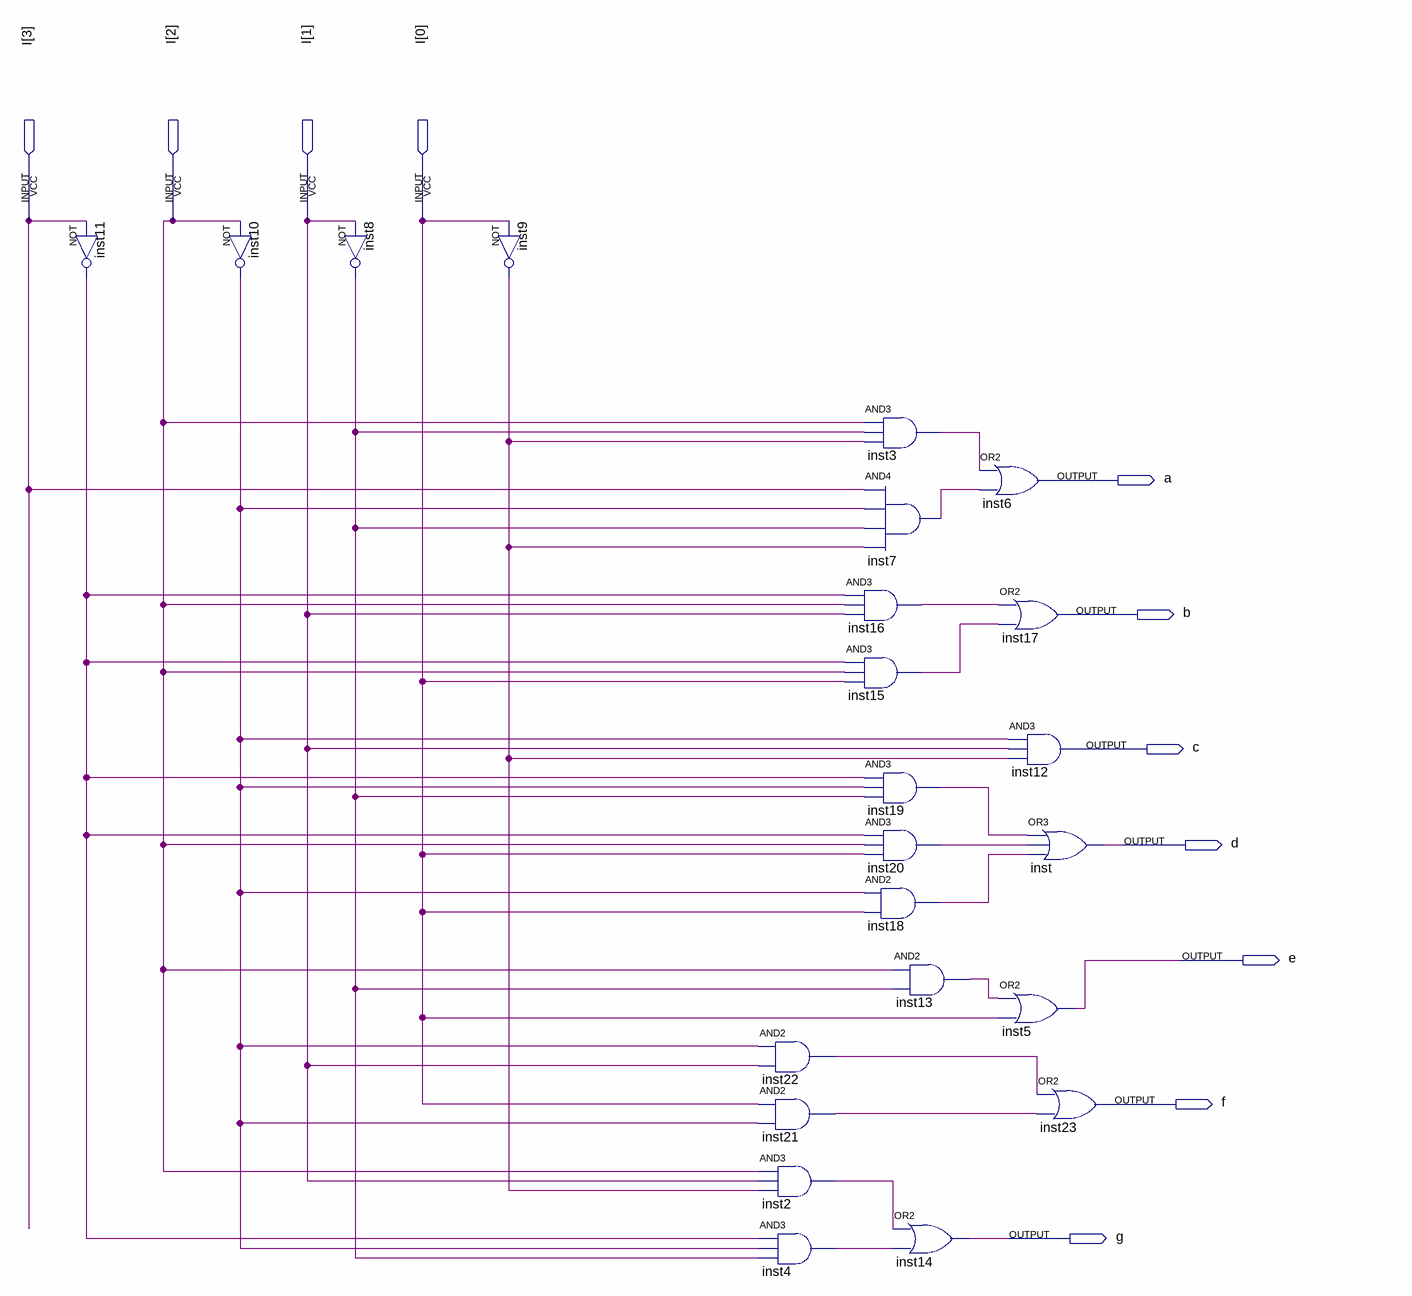
[diagram p0: schematic sheet]
// Quartus schematic bit4ToBCD.bdf as structural Verilog: 23 symbols, 11 pins
module bit4ToBCD (
  input  [3:0] I,
  output a,
  output b,
  output c,
  output d,
  output e,
  output f,
  output g
);

  wire inst2_out, inst3_out, inst4_out, inst7_out, inst8_out, inst9_out, inst10_out, inst11_out, inst13_out,
       inst15_out, inst16_out, inst18_out, inst19_out, inst20_out, inst21_out, inst22_out;

  not inst11 (inst11_out, I[3]);
  not inst10 (inst10_out, I[2]);
  not inst8 (inst8_out, I[1]);
  not inst9 (inst9_out, I[0]);
  and inst22 (inst22_out, inst10_out, I[1]);
  and inst21 (inst21_out, I[0], inst10_out);
  and inst2 (inst2_out, I[2], I[1], inst9_out);
  and inst4 (inst4_out, inst11_out, inst10_out, inst8_out);
  and inst3 (inst3_out, I[2], inst8_out, inst9_out);
  and inst7 (inst7_out, I[3], inst10_out, inst8_out, inst9_out);
  and inst16 (inst16_out, inst11_out, I[2], I[1]);
  and inst15 (inst15_out, inst11_out, I[2], I[0]);
  and inst19 (inst19_out, inst11_out, inst10_out, inst8_out);
  and inst20 (inst20_out, inst11_out, I[2], I[0]);
  and inst18 (inst18_out, inst10_out, I[0]);
  and inst13 (inst13_out, I[2], inst8_out);
  or inst14 (g, inst2_out, inst4_out);
  or inst6 (a, inst3_out, inst7_out);
  or inst17 (b, inst16_out, inst15_out);
  and inst12 (c, inst10_out, I[1], inst9_out);
  or inst5 (e, inst13_out, I[0]);
  or inst (d, inst19_out, inst20_out, inst18_out);
  or inst23 (f, inst22_out, inst21_out);
endmodule
